# EAGLE design untitled (EAGLE 9.6.1)
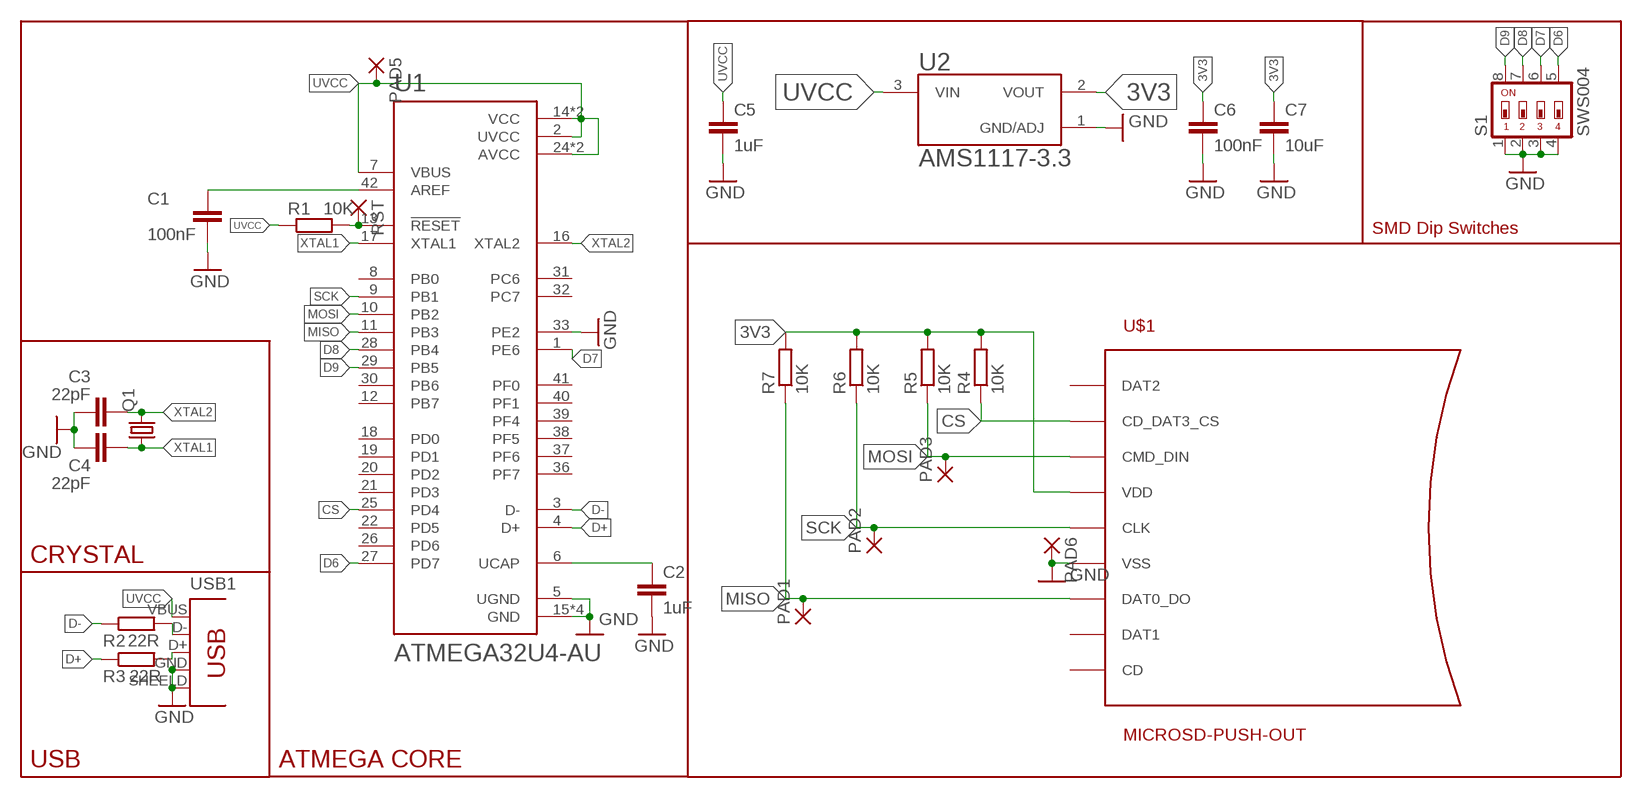
[diagram p0: schematic, sheet 1]

## Parts
C1  100nF  C-EUC0603  [C0603]
C2  1uF  C-EUC0603  [C0603]
C3  22pF  C-EUC0603  [C0603]
C4  22pF  C-EUC0603  [C0603]
C5  1uF  C-EUC0603  [C0603]
C6  100nF  C-EUC0603  [C0603]
C7  10uF  C-EUC0603  [C0603]
PAD1  1,6/0,8  [1,6/0,8]
PAD2  1,6/0,8  [1,6/0,8]
PAD3  1,6/0,8  [1,6/0,8]
PAD5  1,6/0,8  [1,6/0,8]
PAD6  1,6/0,8  [1,6/0,8]
Q1  CRYSTALCTS406  [CTS406]
R1  10K  R-EU_R0603  [R0603]
R2  22R  R-EU_R0603  [R0603]
R3  22R  R-EU_R0603  [R0603]
R4  10K  R-EU_R0603  [R0603]
R5  10K  R-EU_R0603  [R0603]
R6  10K  R-EU_R0603  [R0603]
R7  10K  R-EU_R0603  [R0603]
RST  1,6/0,8  [1,6/0,8]
S1  SWS004  [SMS-004]
U1  ATMEGA32U4-AU  [QFP80P1200X1200X120-44N]
U2  AMS1117-3.3  [SOT229P700X180-4N]
U$1  MICROSD-PUSH-OUT  [MICROSD-PUSH-OUT]
USB1  TYPE-A-MALE-SHILED  [TYPE-A-MALE]

## Nets
3V3: C6.1 C7.1 R4.2 R5.2 R6.2 R7.2 U2.2(VOUT) U$1.4(VDD)
CS: R4.1 U1.25(PD4) U$1.2(CD_DAT3_CS)
D6: S1.5 U1.27(PD7)
D7: S1.6 U1.1(PE6)
D8: S1.7 U1.28(PB4)
D9: S1.8 U1.29(PB5)
D+: R3.1 U1.4(D+)
D-: R2.1 U1.3(D-)
GND: C1.2 C2.2 C3.1 C4.1 C5.2 C6.2 C7.2 PAD6.1(P) S1.1 S1.2 S1.3 S1.4 U1.5(UGND) U1.15(GND) U1.23(GND) U1.33(PE2) U1.35(GND) U1.43(GND) U2.1(GND/ADJ) U$1.6(VSS) U$1.G1(VSS) U$1.G2(VSS) U$1.G3(VSS) U$1.G4(VSS) USB1.GND USB1.SHEELD
MISO: PAD1.1(P) R7.1 U1.11(PB3) U$1.7(DAT0_DO)
MOSI: PAD3.1(P) R5.1 U1.10(PB2) U$1.3(CMD_DIN)
N$1: R2.2 USB1.D-
N$2: C1.1 U1.42(AREF)
N$3: C2.1 U1.6(UCAP)
N$5: R3.2 USB1.D+
RST: R1.2 RST.1(P) U1.13(!RESET)
SCK: PAD2.1(P) R6.1 U1.9(PB1) U$1.5(CLK)
UVCC: C5.1 PAD5.1(P) R1.1 U1.2(UVCC) U1.7(VBUS) U1.14(VCC) U1.24(AVCC) U1.34(VCC) U1.44(AVCC) U2.3(VIN) USB1.VBUS
XTAL1: C4.2 Q1.1 U1.17(XTAL1)
XTAL2: C3.2 Q1.3 U1.16(XTAL2)
Unconnected: U1.8(PB0) U1.12(PB7) U1.18(PD0) U1.19(PD1) U1.20(PD2) U1.21(PD3) U1.22(PD5) U1.26(PD6) U1.30(PB6) U1.31(PC6) U1.32(PC7) U1.36(PF7) U1.37(PF6) U1.38(PF5) U1.39(PF4) U1.40(PF1) U1.41(PF0) U$1.1(DAT2) U$1.8(DAT1) U$1.CD

## Notes on the sheet
- SMD Dip Switches
- CRYSTAL
- USB | ATMEGA CORE

## Library data of the parts
C1-C7 = rcl:C-EU: CAPACITOR, European symbol; OC_FARNELL: unknown; SPICEPREFIX: C
PAD1-PAD3 PAD5 PAD6 RST = wirepad:1,6/0,8: THROUGH-HOLE PAD
Q1 = crystal:CRYSTAL: CRYSTAL; OC_FARNELL: unknown; OC_NEWARK: unknown
R1-R7 = rcl:R-EU_: RESISTOR, European symbol; OC_FARNELL: unknown; SPICEPREFIX: R
S1 = smd-special:SWS004: SMD Dip Switch 4 pol.
U1 = ATMEGA32U4-AU:ATMEGA32U4-AU: ATmega Series 16 MHz 32 KB Flash 2.5 KB SRAM 8-Bit Microcontroller - TQFP-44 Check availability <https://pricing.snapeda.com/parts/ATMEGA32U4-AU/Microchip/view-part?ref=eda>; AVAILABILITY: In Stock; CHECK_PRICES: https://www.snapeda.com/parts/ATMEGA32U4-AU/Microchip/view-part/?ref=eda; DESCRIPTION: Microcontroller, USB controller 16/32K of ISP flash, TQFP44 industrial, 8-bit | Microchip Technology Inc. ATMEGA32U4-AU; MF: Microchip; MP: ATMEGA32U4-AU; PACKAGE: TQFP-44 Microchip; PRICE: None; PURCHASE-URL: https://www.snapeda.com/api/url_track_click_mouser/?unipart_id=50641&manufacturer=Microchip&part_name=ATMEGA32U4-AU&search_term=atmega32u4-au; SNAPEDA_LINK: https://www.snapeda.com/parts/ATMEGA32U4-AU/Microchip/view-part/?ref=snap
U2 = AMS1117-3.3:AMS1117-3.3: Check availability <https://pricing.snapeda.com/parts/AMS1117-3.3/Advanced%20Monolithic%20Systems/view-part?ref=eda>; AVAILABILITY: Not in stock; CHECK_PRICES: https://www.snapeda.com/parts/AMS1117-3.3/Advanced+Monolithic+Systems/view-part/?ref=eda; DESCRIPTION: Sot223/Pkg 1-Amp 3.3-Volt Low Drop Out Voltage Regulatator; MF: Advanced Monolithic Systems; MP: AMS1117-3.3; OC_FARNELL: unknown; PACKAGE: SOT-223 Seeed Technology; PRICE: None; SNAPEDA_LINK: https://www.snapeda.com/parts/AMS1117-3.3/Advanced+Monolithic+Systems/view-part/?ref=snap
U$1 = microsd:MICROSD-PUSH-OUT: T-Flash Push-Out Micro SD Card Reader 14.75mm x 14.5mm SMD with external pins
USB1 = usb-connector:TYPE-A-MALE-SHILED; OC_FARNELL: unknown

## Board
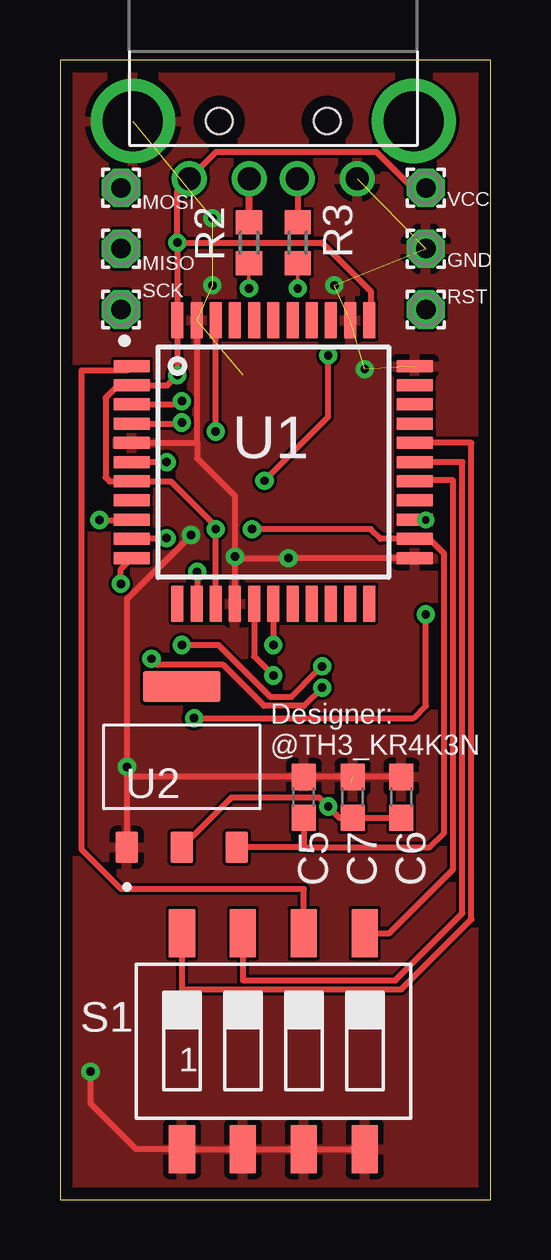
[diagram p1: board, top side]
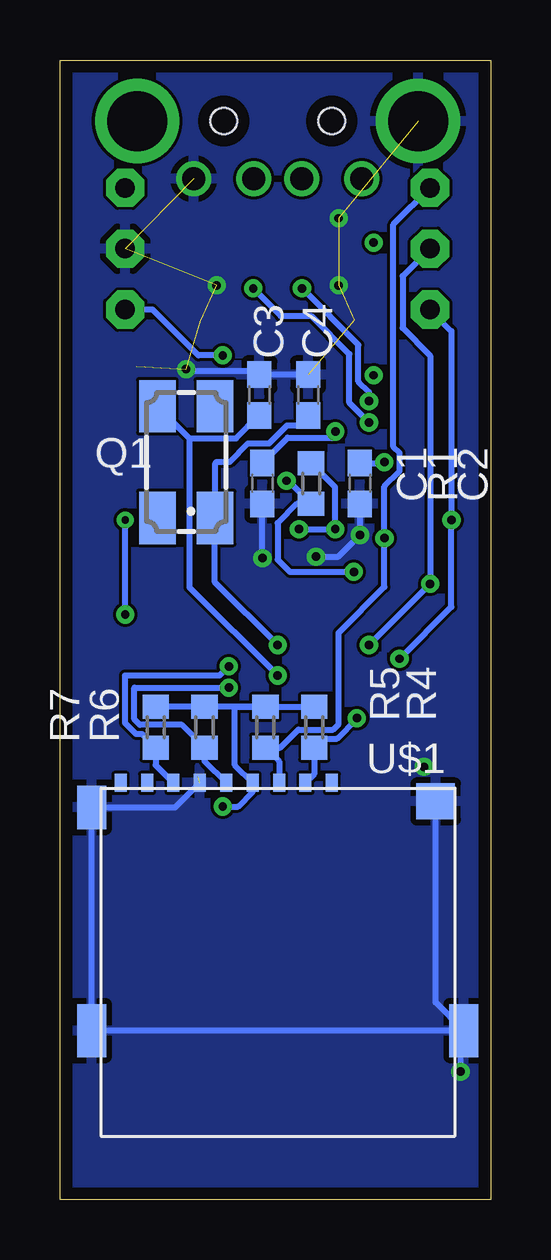
[diagram p2: board, bottom side, seen from below]

Size 17.96 x 47.49 mm. Coordinates in mm from the lower left corner, seen from the top.
Outline: 0,0 17.96,0 17.96,47.49 0,47.49 0,0
Copper layers (1*16): Top 0.035mm / dielectric 1.5mm / Bottom 0.035mm
Design rules "default *": minimum track width 5mil, minimum drill 0.3mm, track to track 5mil, track to pad 5mil, pad to pad 5mil, via to via 5mil, smd to smd 5mil, copper to edge 20mil, drill to drill 5mil, minimum pad ring 10mil, minimum via ring 8mil, stop-mask expansion 4mil, vias tented up to drill 0mil, thermal gap 10mil

### Footprints (pad centres in the part's own frame; a part is rotated, then mirrored left to right if it is on the bottom)
C0603 = smd 1.1 x 1: 1 -0.85,0; 2 0.85,0
1,6/0,8 = drill 0.813 pad 1.6 octagon: 1 0,0
CTS406 = smd 2.184 x 1.524: 1 -2.327,-1.2; 2 2.327,-1.2; 3 2.327,1.2; 4 -2.327,1.2
R0603 = smd 1 x 1.1: 1 -0.85,0; 2 0.85,0
SMS-004 = smd 1.092 x 2.007: 1 -3.81,-4.496; 2 -1.27,-4.496; 3 1.27,-4.496; 4 3.81,-4.496; 5 3.81,4.496; 6 1.27,4.496; 7 -1.27,4.496; 8 -3.81,4.496
QFP80P1200X1200X120-44N = smd 1.5 x 0.5: 1 -5.9,4; 2 -5.9,3.2; 3 -5.9,2.4; 4 -5.9,1.6; 5 -5.9,0.8; 6 -5.9,0; 7 -5.9,-0.8; 8 -5.9,-1.6; 9 -5.9,-2.4; 10 -5.9,-3.2; 11 -5.9,-4; 23 5.9,-4; 24 5.9,-3.2; 25 5.9,-2.4; 26 5.9,-1.6; 27 5.9,-0.8; 28 5.9,0; 29 5.9,0.8; 30 5.9,1.6; 31 5.9,2.4; 32 5.9,3.2; 33 5.9,4 | smd 0.5 x 1.5: 12 -4,-5.9; 13 -3.2,-5.9; 14 -2.4,-5.9; 15 -1.6,-5.9; 16 -0.8,-5.9; 17 0,-5.9; 18 0.8,-5.9; 19 1.6,-5.9; 20 2.4,-5.9; 21 3.2,-5.9; 22 4,-5.9; 34 4,5.9; 35 3.2,5.9; 36 2.4,5.9; 37 1.6,5.9; 38 0.8,5.9; 39 0,5.9; 40 -0.8,5.9; 41 -1.6,5.9; 42 -2.4,5.9; 43 -3.2,5.9; 44 -4,5.9
SOT229P700X180-4N = smd 1.31 x 0.93: 1 -3.345,2.29; 2 -3.345,0; 3 -3.345,-2.29 | smd 1.31 x 3.24: 4 3.345,0
MICROSD-PUSH-OUT = smd 0.5 x 0.75: 1 9.625,0.225; 2 8.525,0.225; 3 7.425,0.225; 4 6.325,0.225; 5 5.225,0.225; 6 4.125,0.225; 7 3.025,0.225; 8 1.925,0.225; CD 0.825,0.225 | smd 1.2 x 1.8: G1 -0.375,-0.8 | smd 1.2 x 2.2: G2 -0.375,-10.1; G4 15.125,-10.1 | smd 1.6 x 1.5: G3 13.95,-0.55
TYPE-A-MALE = drill 0.95: D+ 1,0; D- -1,0; GND 3.5,0; VBUS -3.5,0 | drill 2.5: SHEELD -5.85,2.4; SHEELD2 5.85,2.4 | hole 1.1: -2.25,2.4; 2.25,2.4

### Placement (x,y rotation side)
C1  9.53,29.84 270 bottom
C2  5.46,29.84 270 bottom
C3  9.65,33.53 270 bottom
C4  7.62,33.53 270 bottom
C5  10.16,16.76 90 top
C6  14.22,16.76 90 top
C7  12.19,16.76 90 top
PAD1  2.54,39.62 0 top
PAD2  2.54,37.08 0 top
PAD3  2.54,42.16 0 top
PAD5  15.24,42.16 0 top
PAD6  15.24,39.62 0 top
Q1  12.7,30.73 90 bottom
R1  7.49,29.84 270 bottom
R2  7.87,39.88 90 top
R3  9.91,39.88 90 top
R4  7.37,19.68 90 bottom
R5  9.4,19.68 90 bottom
R6  11.94,19.68 90 bottom
R7  13.97,19.68 90 bottom
RST  15.24,37.08 0 top
S1  8.89,6.6 0 top
U1  8.89,30.73 0 top
U2  5.08,18.03 90 top
U$1  16.26,17.14 0 bottom
USB1  8.89,42.55 0 top

### Tracks (layer width: path | path; a pad name or v marks a point on that pad's centre or on a via)
3V3  (via drill 0.35)
  Top 0.254: U2.2 7.16,16.76 10.79,16.76 v11.18,16.38 11.64,15.91 C7.1 C6.1
  Bottom 0.254: R5.2 10.58,20.54 10.67,20.45 10.67,18.11 U$1.4 9.93,16.99 10.54,16.38 v11.18,16.38 | R5.2 R6.2 R7.2 | R5.2 R4.2
CS  (via drill 0.3, 0.35)
  Top 0.254: v5.59,20.07 14.73,20.07 15.24,20.57 v15.24,24.38 | U1.25 14.8,28.32 v15.24,28.32
  Bottom 0.254: U$1.2 7.37,17.73 R4.1 6.99,19.21 6.42,19.21 5.59,20.04 v5.59,20.07 | v15.24,24.38 v15.24,28.32
D6
  Top 0.254: S1.5 13.72,11.1 16.38,13.77 16.38,29.97 14.83,29.97 U1.27
D7
  Top 0.254: U1.1 2.8,34.54 0.89,34.54 0.89,14.61 2.54,12.95 10.16,12.95 S1.6 10.16,10.41
D8
  Top 0.254: S1.7 7.62,9.14 13.97,9.14 16.76,11.94 16.76,30.73 U1.28
D9
  Top 0.254: S1.8 5.08,8.76 14.22,8.76 17.14,11.68 17.14,31.53 U1.29
D+  (via drill 0.35)
  Top 0.152: v9.91,37.97 R3.1
  Top 0.254: U1.4 5.03,32.33 v5.08,32.38
  Bottom 0.254: v5.08,32.38 5.34,32.64 5.9,33.2 5.9,35.23 7.5,36.83 8.76,36.83 v9.91,37.97
D-  (via drill 0.35)
  Top 0.152: v7.87,37.97 R2.1
  Top 0.254: U1.3 4.94,33.13 v5.08,33.27
  Bottom 0.254: v5.08,33.27 5.08,33.65 5.52,34.09 5.52,35.62 v7.87,37.97
GND  (via drill 0.35)  (10 unrouted)
  Top 0.254: U1.5 5.71,31.53 | U1.43 5.71,36.61 5.71,31.53 | 12.06,36.66 U1.35 12.06,36.61 | v7.29,26.8 7.29,29.32 5.71,30.9 5.71,31.53 | S1.4 S1.3 S1.2 S1.1 3.17,2.11 1.27,4.01 v1.27,5.33 | v7.29,26.8 U1.15 | U1.23 v9.52,26.73 7.35,26.73 v7.29,26.8 | v5.46,27.69 2.79,25.02 v2.79,18.03 | v2.79,18.03 2.79,17.65 2.83,17.61 C5.2 C7.2 C6.2 | v2.79,18.03 U2.1
  Bottom 0.254: v7.29,26.8 6.36,26.8 v5.46,27.69 C2.2 | v9.52,26.73 C1.2 | U$1.G4 U$1.G2 U$1.G1 13.16,16.34 U$1.6 | U$1.G4 2.31,8.22 U$1.G3 2.79,17.08 | C4.1 C3.1 9.82,34.54 12.64,34.54 v12.7,34.61 | v1.27,5.33 1.27,6.91 U$1.G4
  other vias: 6.35,40.89 11.43,38.1 6.35,38.1
  pour Bottom: 0,0 0,47.5 18.03,47.5 18.03,0
  pour Top: 0,0 0,47.5 18.03,47.5 18.03,0
MISO  (via drill 0.35)
  Top 0.254: v10.92,22.23 10.66,21.97 9.65,20.95 8.76,20.95 6.6,23.11 v5.08,23.11 | v2.53,25.66 2.53,26.28 U1.11
  Bottom 0.254: U$1.7 13.97,18.11 R7.1 14.54,19.4 14.78,19.4 15.24,19.86 15.24,21.84 11.31,21.84 11.18,21.97 v10.92,22.23 | v5.08,23.11 v5.08,23.12 v2.53,25.66 2.53,35.17 3.68,36.32 3.68,38.48 PAD1.1
MOSI  (via drill 0.35)
  Top 0.254: v4.44,27.57 4.41,27.53 U1.10
  Bottom 0.254: U$1.3 8.83,18.27 R5.1 8.78,18.84 8.02,19.59 6.57,19.59 6.35,19.81 6.35,23.62 4.44,25.53 v4.44,27.57 4.44,29.72 3.81,30.35 3.81,31.11 4.06,31.37 4.06,40.64 PAD3.1
N$1
  Top 0.254: R2.2 7.87,40.89 | 7.87,40.89 7.87,42.53 | USB1.D- 7.89,40.91 7.87,40.89
N$2  (via drill 0.35)
  Top 0.254: v6.48,32.01 U1.42
  Bottom 0.254: C1.1 8.47,31.75 6.48,31.75 v6.48,32 v6.48,32.01
N$3  (via drill 0.35)
  Top 0.254: v4.45,30.73 U1.6
  Bottom 0.254: C2.1 4.48,30.7 v4.45,30.73
N$5
  Top 0.254: USB1.D+ 9.91,42.53 R3.2
RST  (via drill 0.35)
  Top 0.254: v5.71,26.16 5.71,24.86 U1.13 | v8.52,29.96 11.18,32.61 v11.18,35.18
  Bottom 0.254: v5.71,26.16 8.38,26.16 8.89,26.67 8.89,28.19 8.09,29 R1.2 8.46,29.96 v8.52,29.96 | v11.18,35.18 12.19,35.18 14.1,37.08 RST.1
SCK  (via drill 0.35)
  Top 0.254: v10.92,21.34 10.16,20.57 8.51,20.57 6.79,22.29 4.06,22.29 v3.81,22.54 | v1.65,28.32 2.98,28.32 U1.9
  Bottom 0.254: U$1.5 11.94,18.28 R6.1 12.88,19.78 14.62,19.78 14.86,20.02 14.86,21.34 v10.92,21.34 | v3.81,22.54 1.65,24.7 v1.65,28.32 1.65,36.19 PAD2.1
UVCC  (via drill 0.35)
  Top 0.152: 2.54,33.93 U1.2
  Top 0.254: v4.89,39.88 10.92,39.88 12.95,37.85 12.95,36.7 U1.34 | U1.14 v6.49,27.94 6.49,28.05 4.61,29.93 U1.7 2.07,29.93 1.91,30.1 1.91,33.41 2.43,33.93 U1.2 4.47,33.93 v4.89,34.35 U1.44 v4.89,39.88 | U1.24 14.23,27.53 | U1.24 13.36,27.53 12.95,27.94 v8,27.94 | U1.24 15.39,27.53 16,26.92 16,15.28 15.41,14.69 10.16,14.69 | 10.16,14.69 U2.3 | C5.1 10.16,14.69 | v4.89,39.88 4.89,42.05 USB1.VBUS 6.5,43.66 13.19,43.66 14.68,42.16 PAD5.1
  Bottom 0.254: v8,27.94 v6.49,27.94 6.49,29.69 R1.1
XTAL1  (via drill 0.35)
  Top 0.254: U1.17 v8.89,23.11
  Bottom 0.254: C4.2 8.04,32.26 8.5,32.26 9.26,31.5 10.13,31.5 10.89,30.73 11.43,30.73 11.5,30.66 Q1.1 11.5,25.72 v8.89,23.11
XTAL2  (via drill 0.35)
  Top 0.254: U1.16 8.09,22.64 v8.89,21.84
  Bottom 0.254: C3.2 9.67,32.68 10.63,31.71 12.55,31.71 | 12.55,31.71 Q1.3 | v8.89,21.84 12.55,25.51 12.55,31.71

### Text on the board
tNames: MOSI | VCC | MISO | GND | SCK | RST | Designer: / @TH3_KR4K3N